# EAGLE schematic adapter_stick (EAGLE 6.2)
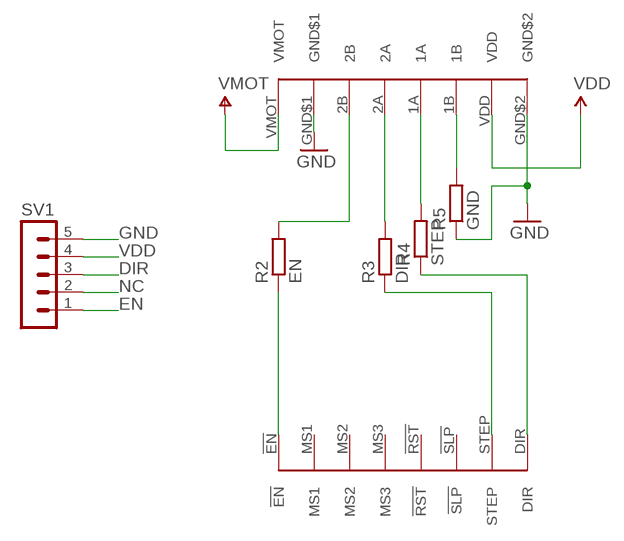
[diagram p0: schematic, sheet 1]

## Parts
J1X  CLONOLU  [CLONOLU]
R2  EN  R-EU_R0402  [R0402]
R3  DIR  R-EU_R0402  [R0402]
R4  STEP  R-EU_R0402  [R0402]
R5  GND  R-EU_R0402  [R0402]
SV1  MA05-1  [MA05-1]

## Nets
DIR: J1X.DIR(A4983$1:DIR) R4.1 SV1.3
EN: J1X.!EN(A4983$1:!EN) R2.1 SV1.1
GND: J1X.GND$1(A4983$2:GND$1) J1X.GND$2(A4983$2:GND$2) R5.1 SV1.5
N$1: J1X.1B(A4983$2:1B) R5.2
N$2: J1X.1A(A4983$2:1A) R4.2
N$5: J1X.2B(A4983$2:2B) R2.2
NC: J1X.2A(A4983$2:2A) J1X.STEP(A4983$1:STEP) R3.1 R3.2 SV1.2
VDD: J1X.VDD(A4983$2:VDD) SV1.4
VMOT: J1X.VMOT(A4983$2:VMOT)
Unconnected: J1X.!RST(A4983$1:!RST) J1X.!SLP(A4983$1:!SLP) J1X.MS1(A4983$1:MS1) J1X.MS2(A4983$1:MS2) J1X.MS3(A4983$1:MS3)

## Library data of the parts
J1X = pololu-allegro:CLONOLU
R2-R5 = rcl:R-EU_: RESISTOR, European symbol
SV1 = con-lstb:MA05-1: PIN HEADER; OC_FARNELL: unknown; OC_NEWARK: unknown